# EAGLE design USBIRtoy.v2 (EAGLE 5.10)
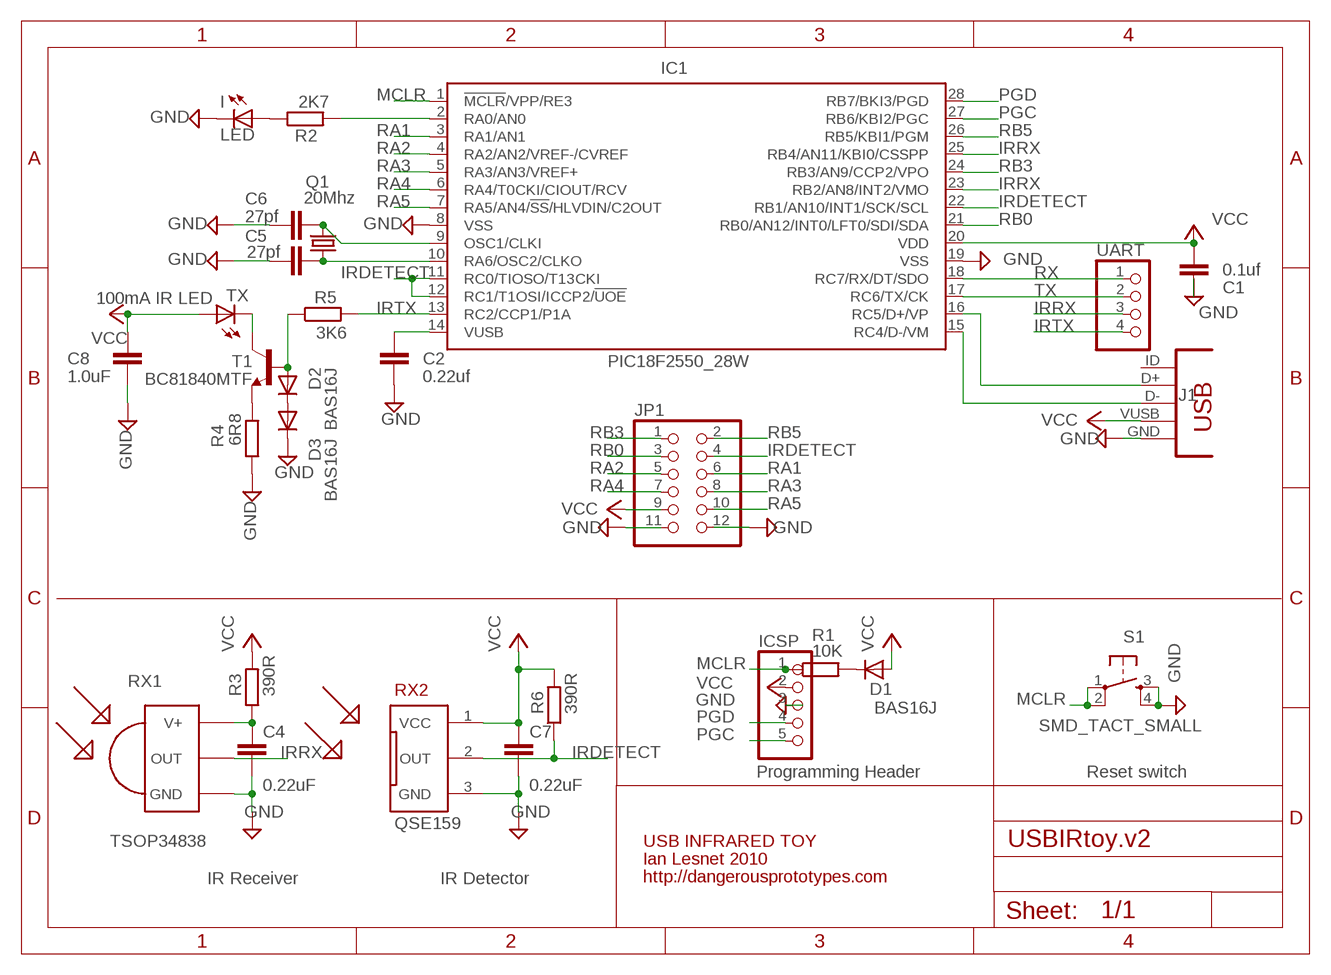
[diagram p0: schematic, sheet 1]

## Parts
C1  0.1uf  CAPC603  [C603]
C2  0.22uf  CAPC603  [C603]
C4  0.22uF  CAPC603  [C603]
C5  27pf  CAPC603  [C603]
C6  27pf  CAPC603  [C603]
C7  0.22uF  CAPC603  [C603]
C8  1.0uF  CAPC603  [C603]
D1  BAS16J  DIODE_SOD-323  [SOD2514X100N]
D2  BAS16J  DIODEDO323  [DO323]
D3  BAS16J  DIODEDO323  [DO323]
I  LED  LEDCHIP-LED0805  [CHIP-LED0805]
IC1  PIC18F2550_28W  [SO28W]
ICSP  PINHD-1X5  [1X05]
J1  CON-USB-MINI-BUSB1  [CONN_USB_MINI-B]
JP1  PINHD-2X6  [2X06]
Q1  20Mhz  CRYSTALHC49UP  [HC49UP]
R1  10K  RESISTORR603  [R603]
R2  2K7  RESISTORR603  [R603]
R3  390R  RESISTORR603  [R603]
R4  6R8  R-EU_M1206  [M1206]
R5  3K6  RESISTORR603  [R603]
R6  390R  RESISTORR603  [R603]
RX  TSOP34838  TSOP4838  [TSOP18XX]
RX2  QSE159  QSE15X  [QSE15X]
S1  SMD_TACT_SMALL  [TACT_SWITCH_SMALL]
T1  BC81840MTF  NPNSOT23BEC  [SOT23-BEC]
TX  100mA IR LED  LED5MM  [LED5MM]
UART  PINHD-1X4  [1X04]

## Nets
GND: C1.2 C2.2 C4.2 C5.2 C6.2 C7.2 C8.2 D3.C I.C IC1.8(VSS) IC1.19(VSS) ICSP.3 J1.GND JP1.11 JP1.12 R4.1 RX2.3(GND) RX.GND S1.3 S1.4
IRDETECT: IC1.11(RC0/TIOSO/T13CKI) IC1.12(RC1/T1OSI/ICCP2/!UOE) IC1.22(RB1/AN10/INT1/SCK/SCL) JP1.4 R6.1 RX2.2(OUT)
IRRX: IC1.23(RB2/AN8/INT2/VMO) IC1.25(RB4/AN11/KBI0/CSSPP) RX.OUT UART.3
IRTX: IC1.13(RC2/CCP1/P1A) R5.2 UART.4
MCLR: IC1.1(!MCLR!/VPP/RE3) ICSP.1 R1.1 S1.1 S1.2
N$1: C6.1 IC1.9(OSC1/CLKI) Q1.2
N$2: C5.1 IC1.10(RA6/OSC2/CLKO) Q1.1
N$3: C2.1 IC1.14(VUSB)
N$6: R4.2 T1.E
N$7: I.A R2.1
N$8: C4.1 R3.1 RX.VCC(V+)
N$9: IC1.2(RA0/AN0) R2.2
N$12: D2.A R5.1 T1.B
N$13: T1.C TX.K(C)
N$14: D2.C D3.A
N$17: D1.K R1.2
PGC: IC1.27(RB6/KBI2/PGC) ICSP.5
PGD: IC1.28(RB7/BKI3/PGD) ICSP.4
RA1: IC1.3(RA1/AN1) JP1.6
RA2: IC1.4(RA2/AN2/VREF-/CVREF) JP1.5
RA3: IC1.5(RA3/AN3/VREF+) JP1.8
RA4: IC1.6(RA4/T0CKI/CIOUT/RCV) JP1.7
RA5: IC1.7(RA5/AN4/!SS!/HLVDIN/C2OUT) JP1.10
RB0: IC1.21(RB0/AN12/INT0/LFT0/SDI/SDA) JP1.3
RB3: IC1.24(RB3/AN9/CCP2/VPO) JP1.1
RB5: IC1.26(RB5/KBI1/PGM) JP1.2
RC4: IC1.15(RC4/D-/VM) J1.D-
RC5: IC1.16(RC5/D+/VP) J1.D+
RX: IC1.18(RC7/RX/DT/SDO) UART.1
TX: IC1.17(RC6/TX/CK) UART.2
VCC: C1.1 C7.1 C8.1 D1.A IC1.20(VDD) ICSP.2 J1.VUSB JP1.9 R3.2 R6.2 RX2.1(VCC) TX.A
Unconnected: J1.BODY@1(BODY) J1.BODY@2(BODY) J1.BODY@3(BODY) J1.BODY@4(BODY) J1.ID(USBID)

## Notes on the sheet
- J1
- RX1
- Programming Header | Reset switch
- TSOP34838 | USB INFRARED TOY
- Ian Lesnet 2010
- IR Receiver | IR Detector
- http://dangerousprototypes.com

## Library data of the parts
C1 C2 C4-C8 = dp_devices:CAP
D1 = ipc-7351-diode:DIODE_
D2 D3 = dp_devices:DIODE
I TX = led:LED: LED OSRAM: - CHIPLED LG R971, LG N971, LY N971, LG Q971, LY Q971, LO R971, LY R971 LH N974, LH R974 LS Q976, LO Q976, LY Q976 LO Q996 - Hyper CHIPLED LW Q18S LB Q993, LB Q99A, LB R99A - SideLED LS A670, LO A670, LY A670, LG A670, LP A670 LB A673, LV A673, LT A673, LW A673 LH A674 LY A675 LS A676, LA A676, LO A676, LY A676, LW A676 LS A679, LY A679, LG A679 - Hyper Micro SIDELED® LS Y876, LA Y876, LO Y876, LY Y876 LT Y87S - SmartLED LW L88C, LW L88S LB L89C, LB L89S, LG L890 LS L89K, LO L89K, LY L89K LS L896, LA L896, LO L896, LY L896 - TOPLED LS T670, LO T670, LY T670, LG T670, LP T670 LSG T670, LSP T670, LSY T670, LOP T670, LYG T670 LG T671, LOG T671, LSG T671 LB T673, LV T673, LT T673, LW T673 LH T674 LS T676, LA T676, LO T676, LY T676, LB T676, LH T676, LSB T676, LW T676 LB T67C, LV T67C, LT T67C, LS T67K, LO T67K, LY T67K, LW E67C LS E67B, LA E67B, LO E67B, LY E67B, LB E67C, LV E67C, LT E67C LW T67C LS T679, LY T679, LG T679 LS T770, LO T770, LY T770, LG T770, LP T770 LB T773, LV T773, LT T773, LW T773 LH T774 LS E675, LA E675, LY E675, LS T675 LS T776, LA T776, LO T776, LY T776, LB T776 LHGB T686 LT T68C, LB T68C - Hyper Mini TOPLED® LB M676 - Mini TOPLED Santana® LG M470 LS M47K, LO M47K, LY M47K Source: http://www.osram.convergy.de LUXEON: - LUMILED® LXK2-PW12-R00, LXK2-PW12-S00, LXK2-PW14-U00, LXK2-PW14-V00 LXK2-PM12-R00, LXK2-PM12-S00, LXK2-PM14-U00 LXK2-PE12-Q00, LXK2-PE12-R00, LXK2-PE12-S00, LXK2-PE14-T00, LXK2-PE14-U00 LXK2-PB12-K00, LXK2-PB12-L00, LXK2-PB12-M00, LXK2-PB14-N00, LXK2-PB14-P00, LXK2-PB14-Q00 LXK2-PR12-L00, LXK2-PR12-M00, LXK2-PR14-Q00, LXK2-PR14-R00 LXK2-PD12-Q00, LXK2-PD12-R00, LXK2-PD12-S00 LXK2-PH12-R00, LXK2-PH12-S00 LXK2-PL12-P00, LXK2-PL12-Q00, LXK2-PL12-R00 Source: www.luxeon.com KINGBRIGHT: KA-3528ASYC Source: www.kingbright.com
IC1 = microchip:PIC18F2*_28: USB Microcontrollers with nanoWatt Technology High-Performance, Enhanced Flash, 28/40/44-Pin, Source: http://ww1.microchip.com/downloads/en/devicedoc/39632c.pdf
ICSP = pinhead-2:PINHD-1X5: PIN HEADER
J1 = dp_devices:CON-USB-MINI-B: USB connector
JP1 = pinhean-jer:PINHD-2X6: PIN HEADER
Q1 = crystal:CRYSTAL: CRYSTAL
R1-R3 R5 R6 = dp_devices:RESISTOR
R4 = rcl:R-EU_: RESISTOR, European symbol
RX = tsop:TSOP4838: IR Receiver and Demodulator
RX2 = dp_devices:QSE15X
S1 = DP-logo:SMD_TACT_SMALL
T1 = dp_devices:NPN
UART = pinhean-jer:PINHD-1X4: PIN HEADER

## Board
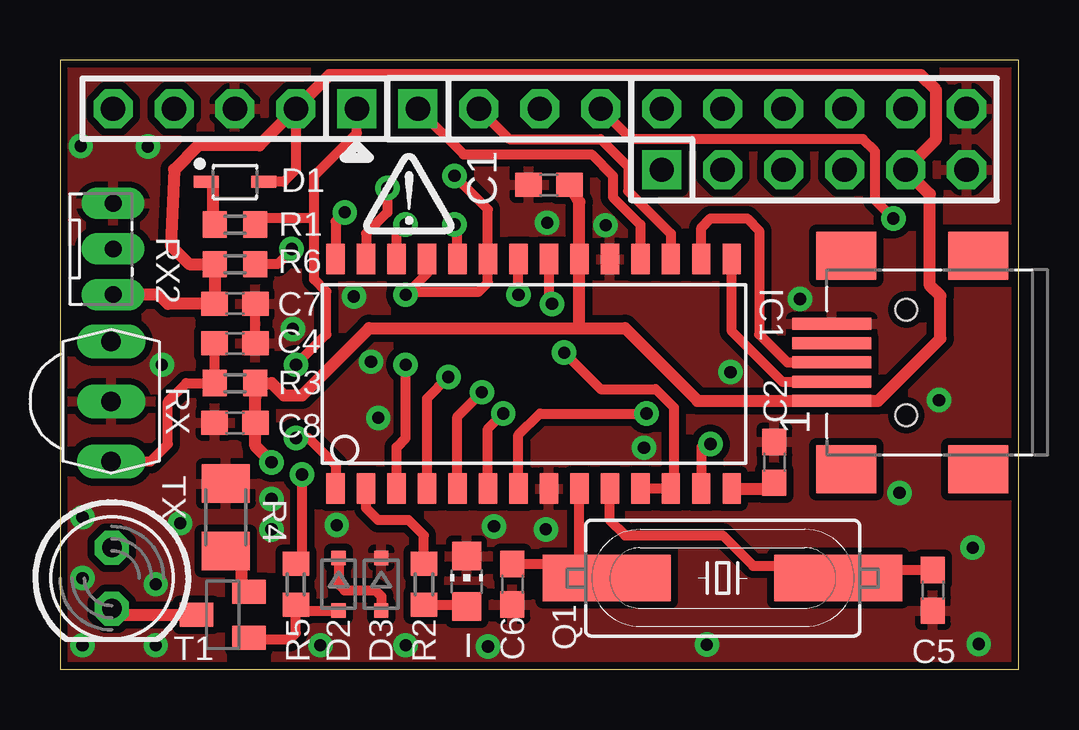
[diagram p1: board, top side]
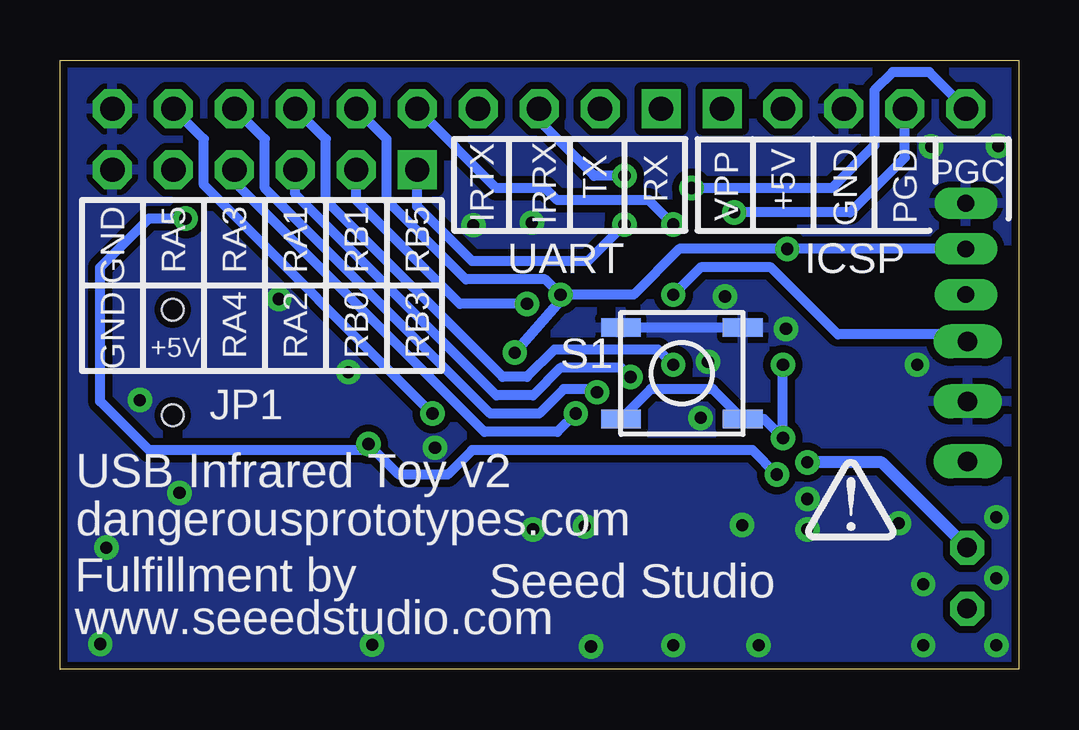
[diagram p2: board, bottom side, seen from below]

Size 39.94 x 25.4 mm. Coordinates in mm from the lower left corner, seen from the top.
Outline: 39.94,0.01 0,0.01 0,25.39 39.94,25.39
Outline: 39.94,0 39.94,0.01
Outline: 39.94,0.01 39.94,25.39
Outline: 39.94,25.39 39.94,25.4
Copper layers (1*16): Top 0.035mm / dielectric 1.5mm / Bottom 0.035mm
Design rules "SparkFun *": minimum track width 10mil, minimum drill 20mil, track to track 8mil, track to pad 8mil, pad to pad 8mil, via to via 8mil, smd to smd 8mil, copper to edge 10mil, drill to drill 8mil, minimum pad ring 12mil, minimum via ring 10mil, stop-mask expansion 4mil, vias tented up to drill 25mil, thermal gap 10mil

### Footprints (pad centres in the part's own frame; a part is rotated, then mirrored left to right if it is on the bottom)
C603 = smd 1.1 x 1: 1 -0.85,0; 2 0.85,0
SOD2514X100N = smd 1.05 x 0.5: A 1.2,0; K -1.2,0
DO323 = smd 0.6 x 0.6: A 1.1,0; C -1.1,0
CHIP-LED0805 = smd 1.2 x 1.2: A 0,-1.05; C 0,1.05
SO28W = smd 0.762 x 1.27: 1 -7.62,-4.78; 2 -6.35,-4.78; 3 -5.08,-4.78; 4 -3.81,-4.78; 5 -2.54,-4.78; 6 -1.27,-4.78; 7 0,-4.78; 8 1.27,-4.78; 9 2.54,-4.78; 10 3.81,-4.78; 11 5.08,-4.78; 12 6.35,-4.78; 13 7.62,-4.78; 14 8.89,-4.78; 15 8.89,4.78; 16 7.62,4.78; 17 6.35,4.78; 18 5.08,4.78; 19 3.81,4.78; 20 2.54,4.78; 21 1.27,4.78; 22 0,4.78; 23 -1.27,4.78; 24 -2.54,4.78; 25 -3.81,4.78; 26 -5.08,4.78; 27 -6.35,4.78; 28 -7.62,4.78
1X05 = drill 1.016 square: 1 -5.08,0 | drill 1.016 octagon: 2 -2.54,0; 3 0,0; 4 2.54,0; 5 5.08,0
CONN_USB_MINI-B = smd 2 x 2.5: BODY@1 -4.45,2.5; BODY@2 4.45,2.5; BODY@3 4.45,-3; BODY@4 -4.45,-3 | smd 0.5 x 3.3: D+ 0,3.1; D- -0.8,3.1; GND 1.6,3.1; ID 0.8,3.1; VUSB -1.6,3.1 | hole 0.9: -2.2,0; 2.2,0
2X06 = drill 1.016 square: 1 -6.35,-1.27 | drill 1.016 octagon: 2 -6.35,1.27; 3 -3.81,-1.27; 4 -3.81,1.27; 5 -1.27,-1.27; 6 -1.27,1.27; 7 1.27,-1.27; 8 1.27,1.27; 9 3.81,-1.27; 10 3.81,1.27; 11 6.35,-1.27; 12 6.35,1.27
HC49UP = smd 5.334 x 1.93: 1 -4.826,0; 2 4.826,0
R603 = smd 1 x 1.1: 1 -0.85,0; 2 0.85,0
M1206 = smd 1.6 x 2: 1 -1.4,0; 2 1.4,0
TSOP18XX = drill 0.813 long: GND -0.001,-0.027; OUT -2.501,-0.027; VCC 2.499,-0.027
QSE15X = drill 0.7 long: 1 -1.9,-0.51; 2 0,-0.51; 3 1.91,-0.51
TACT_SWITCH_SMALL = smd 1.651 x 0.762: 1 -2.54,1.905; 2 2.54,1.905; 3 -2.54,-1.905; 4 2.54,-1.905
SOT23-BEC = smd 1 x 1.4: B -0.95,-1.1; C 0,1.1; E 0.95,-1.1
LED5MM = drill 0.813 octagon: A -1.27,0; K 1.27,0
1X04 = drill 1.016 square: 1 -3.81,0 | drill 1.016 octagon: 2 -1.27,0; 3 1.27,0; 4 3.81,0

### Placement (x,y rotation side)
C1  20.36,20.19 180 top
C2  29.76,8.64 90 top
C4  7.28,13.59 0 top
C5  36.36,3.3 270 top
C6  18.83,3.56 270 top
C7  7.28,15.24 0 top
C8  7.28,10.29 180 top
D1  7.28,20.32 0 top
D2  11.6,3.56 270 top
D3  13.37,3.56 270 top
I  16.93,3.68 0 top
IC1  19.09,12.32 0 top
ICSP  7.28,23.37 180 top
J1  35.24,12.8 90 top
JP1  31.41,22.1 0 top
Q1  27.6,3.81 180 top
R1  7.28,18.54 180 top
R2  15.15,3.56 90 top
R3  7.28,11.94 0 top
R4  6.9,6.35 270 top
R5  9.82,3.56 90 top
R6  7.28,16.89 180 top
RX  2.15,11.18 270 top
RX2  1.69,17.53 90 top
S1  14.03,12.34 180 bottom
T1  6.77,2.29 90 top
TX  2.15,3.81 270 top
U$1  [DP-LOGO]  12.61,18.14 0 top
U$2  [DP-LOGO]  8.9,5.38 0 bottom
UART  18.71,23.37 0 top

### Tracks (layer width: path | path; a pad name or v marks a point on that pad's centre or on a via)
GND  (via drill 0.51)
  Top 0.406: C4.2 C7.2
  Bottom 0.406: S1.3 S1.4
  other vias: 20.23,5.84 9.69,14.2 20.28,18.62 22.72,18.52 0.85,21.82 3.65,21.79 12.23,15.54 12.94,12.83 13.25,10.49 27.93,12.4 34.96,7.37 36.61,11.23 26.94,1.04 38.27,1.07 38.01,5.08 3.98,3.56 4.23,12.7 17.82,0.97 11.52,6.02 24.32,9.25 30.82,15.44 4.99,6.1 0.93,6.35 8.8,5.84 3.98,1.02 10.83,1.02 18.07,5.97 14.39,1.02 0.93,3.81 0.93,1.02 8.8,7.11
  pour Top (isolate 0.305): -1.1,0 -1.1,25.4 40.81,25.4 40.81,0
  pour Bottom (isolate 0.305): -1.1,0 40.81,0 40.81,25.4 -1.1,25.4
IRDETECT  (via drill 0.51)
  Top 0.406: v20.99,13.21 22.52,11.68 24.8,11.68 25.57,10.92 25.57,7.67 IC1.12 | IC1.12 25.44,7.49 | IC1.12 25.44,7.62 | IC1.12 IC1.11 | R6.1 9.06,16.89 9.56,17.4 9.56,17.45 v9.64,17.53 | v19.09,15.62 IC1.22
  Bottom 0.406: RX2.2 v9.64,17.53 14.14,17.53 16.04,15.62 v19.09,15.62 | JP1.4 26.33,22.1 26.33,19.56 23.03,16.26 19.72,16.26 v19.09,15.62 | v19.09,15.62 19.09,15.37 v20.99,13.21 | v19.09,15.62 18.96,15.75
IRRX  (via drill 0.51)
  Top 0.406: IC1.25 15.28,16.51 v14.39,15.62 14.52,15.75 17.44,15.75 17.82,16.13 IC1.23 17.82,19.18 v16.42,20.57
  Bottom 0.406: RX.OUT 2.41,13.97 7.53,13.97 10.33,16.76 13.25,16.76 v14.39,15.62 | UART.3 19.98,22.86 17.69,20.57 v16.42,20.57
IRTX  (via drill 0.51)
  Top 0.406: IC1.13 26.71,9.27 v27.09,9.4 | v10.07,8.13 10.07,4.25 R5.2 | UART.4 23.79,22.1 33.44,22.1 33.95,21.59 33.95,19.56 v34.71,18.8
  Bottom 0.406: v10.07,8.13 11.09,9.14 22.77,9.14 23.79,8.13 25.82,8.13 v27.09,9.4 27.34,9.14 36.23,9.14 38.27,11.18 38.27,16.76 36.23,18.8 v34.71,18.8
MCLR  (via drill 0.51)
  Top 0.406: v9.82,12.7 11.09,13.97 11.09,15.75 10.58,16.26 10.58,18.8 | IC1.1 11.47,8.51 10.33,9.65 v9.82,9.65 | R1.1 8.04,18.29 8.55,18.8 10.58,18.8 | ICSP.1 12.36,22.35 10.58,20.57 10.58,18.8
  Bottom 0.406: S1.2 15.33,11.68 12.74,11.68 S1.1 10.6,10.44 v9.82,9.65 v9.82,12.7
N$1
  Top 0.406: C6.1 21.5,4.41 | 21.5,4.41 22.18,4.41 Q1.2 | IC1.9 21.63,4.53 21.5,4.41
N$2
  Top 0.406: IC1.10 22.9,6.22 23.53,5.59 27.6,5.59 28.87,4.32 31.92,4.32 Q1.1 33.53,4.15 C5.1
N$3
  Top 0.406: C2.1 29.9,7.79
  Top 0.508: 29.99,7.92 C2.1 29.61,7.54 IC1.14
N$6
  Top 0.508: T1.E 7.6,3.49 7.53,3.56 7.53,4.95 R4.2
N$7
  Top 0.406: R2.1 16.73,2.71 I.A
N$8
  Top 0.406: RX.VCC 3.76,8.68 4.48,9.4 4.48,11.18 5.25,11.94 R3.1 C4.1
N$9
  Top 0.406: IC1.2 12.74,6.73 13.25,6.22 14.52,6.22 15.15,5.59 R2.2
N$12
  Top 0.406: D2.A 10.92,2.46 10.03,2.45 R5.1 9.82,1.52 9.56,1.27 7.94,1.27 T1.B
N$13
  Top 0.508: TX.K 2.2,2.54 2.45,2.29 T1.C
N$14
  Top 0.406: D2.C 11.6,3.56 11.85,3.3 13.12,3.3 13.37,3.05 D3.A
N$17
  Top 0.406: R1.2 6.36,18.58
  Top 0.508: 6.36,18.58 6.36,20.29 D1.K
PGC  (via drill 0.51)
  Top 0.406: v13.63,20.07 13.63,19.05 12.74,18.16 IC1.27
  Bottom 0.406: v13.63,20.07 7.79,20.07 6.01,21.84 6.01,24.13 5.25,24.89 3.72,24.89 ICSP.5
PGD  (via drill 0.51)
  Top 0.406: IC1.28 11.47,18.67 v11.85,19.05
  Bottom 0.406: v11.85,19.05 7.02,19.05 4.74,21.34 ICSP.4
RA1  (via drill 0.51)
  Top 0.406: IC1.3 14.01,9.27 14.39,9.65 v14.39,12.7
  Bottom 0.406: JP1.6 28.87,22.1 28.87,19.56 21.5,12.19 20.49,12.19 19.34,13.34 15.02,13.34 v14.39,12.7
RA2  (via drill 0.51)
  Top 0.406: IC1.4 15.28,11.3 v16.17,12.19
  Bottom 0.406: JP1.5 30.14,19.81 21.76,11.43 20.23,11.43 19.09,12.57 16.55,12.57 v16.17,12.19
RA3  (via drill 0.51)
  Top 0.406: IC1.5 16.55,10.54 v17.56,11.56
  Bottom 0.406: JP1.8 31.41,22.1 31.41,20.07 22.01,10.67 19.98,10.67 18.96,11.68 17.69,11.68 v17.56,11.56
RA4  (via drill 0.51)
  Top 0.406: IC1.6 17.82,10.03 v18.45,10.67
  Bottom 0.406: JP1.7 32.68,20.32 22.26,9.91 19.22,9.91 v18.45,10.67
RA5  (via drill 0.51)
  Top 0.406: IC1.7 19.09,9.78 19.98,10.67 v24.42,10.67
  Bottom 0.406: JP1.10 33.95,22.1 33.95,20.19 v24.42,10.67
RB0  (via drill 0.51)
  Top 0.406: IC1.21 20.36,15.37 v20.49,15.24
  Bottom 0.406: JP1.3 27.6,19.56 23.28,15.24 v20.49,15.24
RB3  (via drill 0.51)
  Top 0.406: IC1.24 16.55,18.29 v16.42,18.54
  Bottom 0.406: JP1.1 25.06,19.3 22.77,17.02 17.95,17.02 v16.42,18.54 16.55,18.41
RB5  (via drill 0.51)
  Top 0.406: IC1.26 14.01,18.16 v14.39,18.54
  Bottom 0.406: JP1.2 21.76,20.07 19.72,20.07 19.22,19.56 15.41,19.56 v14.39,18.54
RC4
  Top 0.406: J1.D- 30.07,12 27.98,14.1 IC1.15
RC5
  Top 0.406: IC1.16 26.71,18.41 27.09,18.8 28.61,18.8 29.12,18.29 29.12,13.97 30.29,12.8 J1.D+
RX
  Top 0.406: IC1.18 24.17,18.54 23.03,19.68 23.03,20.57 22.14,21.46 16.8,21.46 UART.1
TX
  Top 0.406: IC1.17 25.44,18.16 23.66,19.94 23.66,20.95 22.52,22.1 18.71,22.1 UART.2
VCC  (via drill 0.51)
  Top 0.406: C7.1 6.33,15.12 | ICSP.2 9.82,20.83 9.31,20.32 D1.A
  Top 0.508: 21.63,14.22 IC1.20 21.63,19.49 C1.1 | RX2.1 4.1,15.63 4.48,15.24 C7.1 R6.2 5.37,16.89 4.61,17.65 4.74,20.83 5.75,21.84 8.29,21.84 ICSP.2 11.21,24.76 35.85,24.76 36.49,24.13 36.49,22.1 JP1.9 36.23,19.81 36.23,16 36.67,15.57 36.67,13.79 34.07,11.2 J1.VUSB 26.56,11.2 23.53,14.22 21.63,14.22 | 21.63,14.22 12.87,14.22 10.07,11.43 9.31,11.43 8.8,11.94 R3.2 8.23,12.13 8.13,11.36 C8.1 8.13,9.31 v8.8,8.64
  Bottom 0.508: v8.8,8.64 5.7,8.64 TX.A

### Text on the board
tNames: RX
bNames: PGC | PGD | GND | +5V | VPP | RX | TX | IRRX | IRTX | RB5 | RB1 | RA1 | RA3 | RA5 | GND | RB3 | RB0 | RA2 | RA4 | GND | +5V | USB Infrared Toy v2 | dangerousprototypes.com | Fulfillment by | Seeed Studio | www.seeedstudio.com
Reference: Programming | Serial | Header | Port | Expansion | RB5 | RB1 | RA1 | RA3 | RA5 | GND | CLOCK | DATA | GND | +5V | MCLR | RX | TX | IRRX | IRTX | RB3 | RB0 | RA2 | RA4 | +5V | GND | USB | LED | USB INFRARED TOY v2 | CC-BY-SA | Ian Lesnet 2010 | http://dangerousprototypes.com